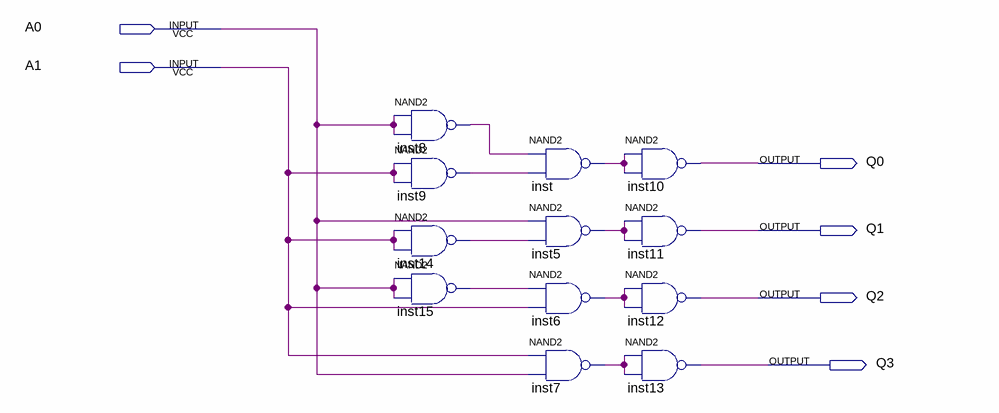
[diagram p0: schematic sheet]
// Quartus schematic DC_2input_2nand.bdf as structural Verilog: 12 symbols, 6 pins
module DC_2input_2nand (
  input  A0,
  input  A1,
  output Q0,
  output Q1,
  output Q2,
  output Q3
);

  wire inst5_out, inst6_out, inst7_out, inst8_out, inst9_out, inst14_out, inst15_out, inst_out;

  nand inst8 (inst8_out, A0, A0);
  nand inst9 (inst9_out, A1, A1);
  nand inst14 (inst14_out, A1, A1);
  nand inst15 (inst15_out, A0, A0);
  nand inst (inst_out, inst8_out, inst9_out);
  nand inst5 (inst5_out, A0, inst14_out);
  nand inst6 (inst6_out, inst15_out, A1);
  nand inst7 (inst7_out, A1, A0);
  nand inst10 (Q0, inst_out, inst_out);
  nand inst11 (Q1, inst5_out, inst5_out);
  nand inst12 (Q2, inst6_out, inst6_out);
  nand inst13 (Q3, inst7_out, inst7_out);
endmodule
